# EAGLE design bbb_light_2021-04-30 (EAGLE 9.5.2)
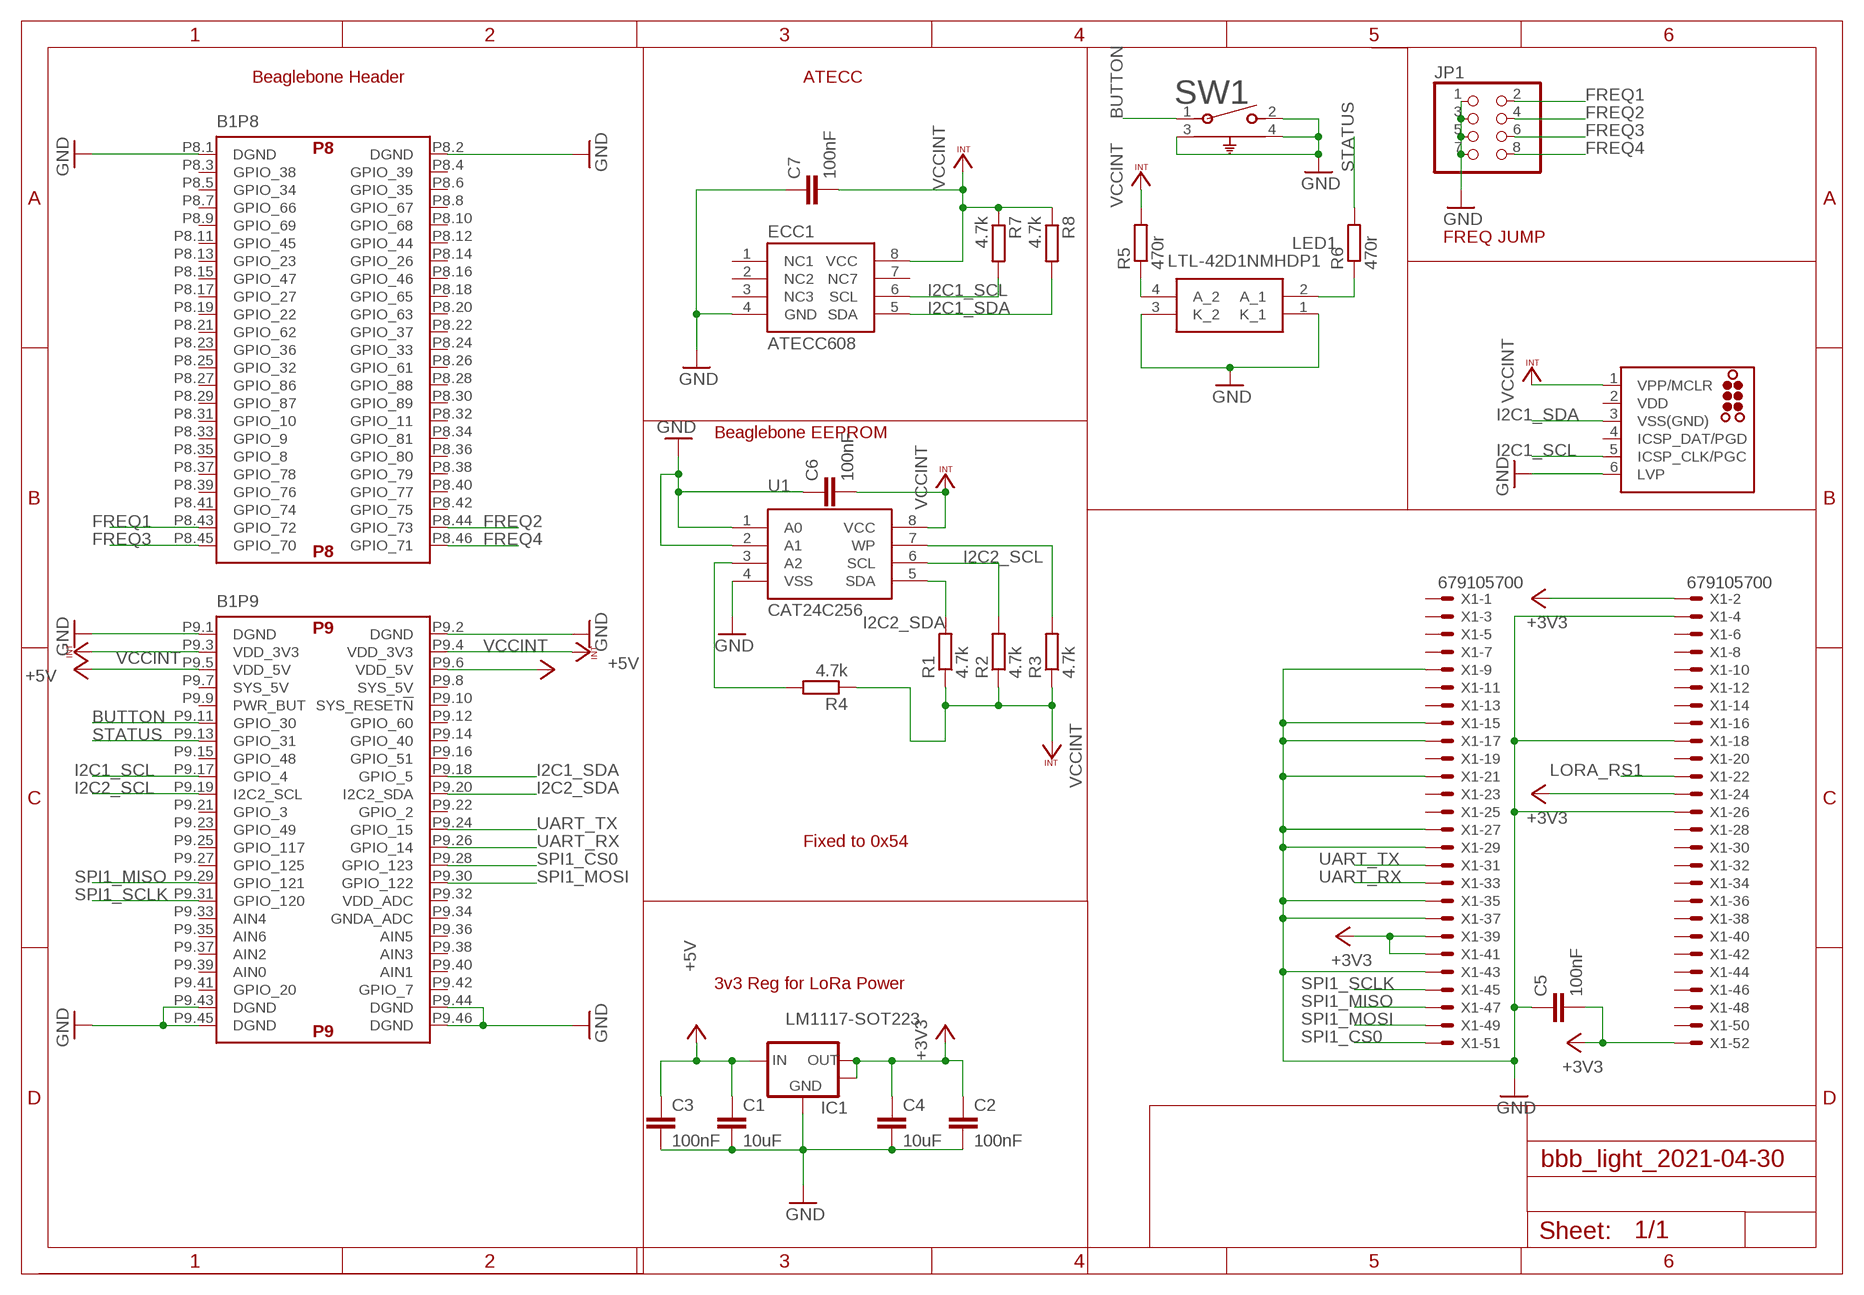
[diagram p0: schematic, sheet 1]

## Parts
B1  SPARKFUN_BEAGLE_BONE_BLACK_CAPE  [BEAGLE_BONE_BLACK_CAPE]
C1  10uF  C-EUC0603  [C0603]
C2  100nF  C-EUC0603  [C0603]
C3  100nF  C-EUC0603  [C0603]
C4  10uF  C-EUC0603  [C0603]
C5  100nF  C-EUC0603  [C0603]
C6  100nF  C-EUC0603  [C0603]
C7  100nF  C-EUC0603  [C0603]
ECC1  ATECC608  ATECC108  [SO08]
IC1  LM1117-SOT223  [SOT-223-3]
J1  TC2030-MCP-NL  [TC2030-MCP-NL]
JP1  PINHD-2X4  [2X04]
LED1  LTL-42D1NMHDP1  [LTL42D1NMHDP1]
R1  4.7k  R-EU_R0603  [R0603]
R2  4.7k  R-EU_R0603  [R0603]
R3  4.7k  R-EU_R0603  [R0603]
R4  4.7k  R-EU_R0603  [R0603]
R5  470r  R-EU_R0603  [R0603]
R6  470r  R-EU_R0603  [R0603]
R7  4.7k  R-EU_R0603  [R0603]
R8  4.7k  R-EU_R0603  [R0603]
SW1  1825027-8  [SW2_1825027-C_TEC]
U1  CAT24C256  CAT24C32WI-GT3  [SOIC8]
X1  679105700  [679105700]

## Nets
+3V3: C2.1 C4.1 C5.2 IC1.2(VOUT) IC1.4(HEATSINK) X1.2 X1.24 X1.39 X1.41 X1.52
+5V: B1.P9.5(P9:VDD_5V) B1.P9.6(P9:VDD_5V) C1.1 C3.1 IC1.3(VIN)
BUTTON: B1.P9.11(P9:GPIO_30) SW1.1
FREQ1: B1.P8.43(P8:GPIO_72) JP1.2
FREQ2: B1.P8.44(P8:GPIO_73) JP1.4
FREQ3: B1.P8.45(P8:GPIO_70) JP1.6
FREQ4: B1.P8.46(P8:GPIO_71) JP1.8
GND: B1.P8.1(P8:DGND) B1.P8.2(P8:DGND) B1.P9.1(P9:DGND) B1.P9.2(P9:DGND) B1.P9.43(P9:DGND) B1.P9.44(P9:DGND) B1.P9.45(P9:DGND) B1.P9.46(P9:DGND) C1.2 C2.2 C3.2 C4.2 C5.1 C6.1 C7.1 ECC1.4(GND) IC1.1(GND) J1.6(LVP) JP1.1 JP1.3 JP1.5 JP1.7 LED1.1(K_1) LED1.3(K_2) SW1.2 SW1.3 SW1.4 U1.1(A0) U1.2(A1) U1.4(VSS) X1.4 X1.9 X1.15 X1.17 X1.18 X1.21 X1.26 X1.27 X1.29 X1.35 X1.37 X1.43
I2C1_SCL: B1.P9.17(P9:GPIO_4) ECC1.6(SCL) J1.5(ICSP_CLK/PGC) R7.2
I2C1_SDA: B1.P9.18(P9:GPIO_5) ECC1.5(SDA) J1.3(VSS(GND)) R8.2
I2C2_SCL: B1.P9.19(P9:I2C2_SCL) R2.2 U1.6(SCL)
I2C2_SDA: B1.P9.20(P9:I2C2_SDA) R1.2 U1.5(SDA)
LORA_RS1: X1.22
N$3: R3.2 U1.7(WP)
N$4: R4.2 U1.3(A2)
N$5: LED1.4(A_2) R5.1
N$6: LED1.2(A_1) R6.1
SPI1_CS0: B1.P9.28(P9:GPIO_123) X1.51
SPI1_MISO: B1.P9.29(P9:GPIO_121) X1.47
SPI1_MOSI: B1.P9.30(P9:GPIO_122) X1.49
SPI1_SCLK: B1.P9.31(P9:GPIO_120) X1.45
STATUS: B1.P9.13(P9:GPIO_31) R6.2
UART_RX: B1.P9.26(P9:GPIO_14) X1.33
UART_TX: B1.P9.24(P9:GPIO_15) X1.31
VCCINT: B1.P9.3(P9:VDD_3V3) B1.P9.4(P9:VDD_3V3) C6.2 C7.2 ECC1.8(VCC) J1.1(VPP/MCLR) R1.1 R2.1 R3.1 R4.1 R5.2 R7.1 R8.1 U1.8(VCC)
Unconnected: B1.P8.3(P8:GPIO_38) B1.P8.4(P8:GPIO_39) B1.P8.5(P8:GPIO_34) B1.P8.6(P8:GPIO_35) B1.P8.7(P8:GPIO_66) B1.P8.8(P8:GPIO_67) B1.P8.9(P8:GPIO_69) B1.P8.10(P8:GPIO_68) B1.P8.11(P8:GPIO_45) B1.P8.12(P8:GPIO_44) B1.P8.13(P8:GPIO_23) B1.P8.14(P8:GPIO_26) B1.P8.15(P8:GPIO_47) B1.P8.16(P8:GPIO_46) B1.P8.17(P8:GPIO_27) B1.P8.18(P8:GPIO_65) B1.P8.19(P8:GPIO_22) B1.P8.20(P8:GPIO_63) B1.P8.21(P8:GPIO_62) B1.P8.22(P8:GPIO_37) B1.P8.23(P8:GPIO_36) B1.P8.24(P8:GPIO_33) B1.P8.25(P8:GPIO_32) B1.P8.26(P8:GPIO_61) B1.P8.27(P8:GPIO_86) B1.P8.28(P8:GPIO_88) B1.P8.29(P8:GPIO_87) B1.P8.30(P8:GPIO_89) B1.P8.31(P8:GPIO_10) B1.P8.32(P8:GPIO_11) B1.P8.33(P8:GPIO_9) B1.P8.34(P8:GPIO_81) B1.P8.35(P8:GPIO_8) B1.P8.36(P8:GPIO_80) B1.P8.37(P8:GPIO_78) B1.P8.38(P8:GPIO_79) B1.P8.39(P8:GPIO_76) B1.P8.40(P8:GPIO_77) B1.P8.41(P8:GPIO_74) B1.P8.42(P8:GPIO_75) B1.P9.7(P9:SYS_5V) B1.P9.8(P9:SYS_5V) B1.P9.9(P9:PWR_BUT) B1.P9.10(P9:SYS_RESET!N) B1.P9.12(P9:GPIO_60) B1.P9.14(P9:GPIO_40) B1.P9.15(P9:GPIO_48) B1.P9.16(P9:GPIO_51) B1.P9.21(P9:GPIO_3) B1.P9.22(P9:GPIO_2) B1.P9.23(P9:GPIO_49) B1.P9.25(P9:GPIO_117) B1.P9.27(P9:GPIO_125) B1.P9.32(P9:VDD_ADC) B1.P9.33(P9:AIN4) B1.P9.34(P9:GNDA_ADC) B1.P9.35(P9:AIN6) B1.P9.36(P9:AIN5) B1.P9.37(P9:AIN2) B1.P9.38(P9:AIN3) B1.P9.39(P9:AIN0) B1.P9.40(P9:AIN1) B1.P9.41(P9:GPIO_20) B1.P9.42(P9:GPIO_7) ECC1.1(NC1) ECC1.2(NC2) ECC1.3(NC3) ECC1.7(NC7) J1.4(ICSP_DAT/PGD) X1.1 X1.3 X1.5 X1.6 X1.7 X1.8 X1.10 X1.11 X1.12 X1.13 X1.14 X1.16 X1.19 X1.20 X1.23 X1.25 X1.28 X1.30 X1.32 X1.34 X1.36 X1.38 X1.40 X1.42 X1.44 X1.46 X1.48 X1.50

## Notes on the sheet
- Beaglebone Header | ATECC
- FREQ JUMP
- Beaglebone EEPROM
- Fixed to 0x54
- 3v3 Reg for LoRa Power

## Power pins joined to a net without a drawn wire
VDD: J1.2(VDD)

## Library data of the parts
B1 = SparkFun-Boards:SPARKFUN_BEAGLE_BONE_BLACK_CAPE: BeagleBone Black Rev C Cape Generic footprint for BeagleBone Black Rev C Capes. SparkFun Products: SparkFun BeagleBone Black Proto Cape <https://www.sparkfun.com/products/12774> SparkFun CryptoCape <https://www.sparkfun.com/products/12773>
C1-C7 = resistor:C-EU: CAPACITOR, European symbol
ECC1 = SparkFun-IC-Special-Function:ATECC108: ATECC108 ECDSA with NIST ATECC108: Provides ECDSA with NIST curves P256, B283, and K283. Also, a RNG, 8.5Kb EEPROM. 2.0V - 5.5V. Datasheet <https://cdn.sparkfun.com/datasheets/Dev/Beagle/Atmel-8873S-CryptoAuth-ATECC108-Datasheet-Summary.pdf> SparkFun Products CryptoCape <https://www.sparkfun.com/products/12773> (DEV-12773) SparkFun CryptoShield <https://www.sparkfun.com/products/13183> (DEV-13183); PROD_ID: IC-11982; VALUE: ATECC108
IC1 = bt_regulator:LM1117: LDO Voltage Regulator NCP1117 series are low dropout positive voltage regulators that are capable of providing an output current that is in excess of 1.0 A with a maximum dropout voltage of 1.2 V at 800 mA over temperature. This series contains nine fixed output voltages of 1.5 V, 1.8 V, 1.9 V, 2.0 V, 2.5 V, 2.85 V, 3.3 V, 5.0 V, and 12 V that have no minimum load requirement to maintain regulation. Also included is an adjustable output version that can be programmed from 1.25 V to 18.8 V with two external resistors. datasheet.pdf <http://www.onsemi.com/pub_link/Collateral/NCP1117-D.PDF> LM1117-N is a series of low dropout voltage regulators of 1.2V at 800mA of load current. It has the same pin-out as Texas Instruments' industry standard LM317. The LM1117-N is available in an adjustable version, available in five fixed voltages, 1.8V, 2.5V, 2.85V, 3.3V, and 5V. The LM1117-N offers current limiting and thermal shutdown. Its circuit includes a zener trimmed to within ±1%. datasheet.pdf <http://www.ti.com/lit/ds/symlink/lm1117-n.pdf>
J1 = One_Dimensional_Pong:TC2030: TAG-CONNECT ICSP Connector Manufacturer: Tag-Connect <http://www.tag-connect.com> Cable for easy In-Circuit Serial Programming. Designed for Microchip ICD2, suitable for many others. Two variants - one "with legs" (for hands-free fit on PCB) and another "without legs" for quick programming. PAD Description 1 MCLR/Vpp 2 Vdd 3 GND 4 PGD (ISPDAT) 5 PGC (ISPCLK) 6 nc (used for LVP) ©2009 ROFA.cz - modified and updated by Robert Darlington ‹rdarlington@gmail.com›
JP1 = pinhead:PINHD-2X4: PIN HEADER
LED1 = LTL-42D1NMHDP1:LTL-42D1NMHDP1: LED Circuit Board Indicators Housing LED ThruHole 3mm 2Lvl Grn/Yellow Source: Datasheet <https://datasheet.datasheetarchive.com/originals/distributors/Datasheets-305/79387.pdf>; ARROW_PART_NUMBER: LTL-42D1NMHDP1; ARROW_PRICE-STOCK: https://www.arrow.com/en/products/ltl-42d1nmhdp1/lite-on-technology; DESCRIPTION: LED Circuit Board Indicators Housing LED ThruHole 3mm 2Lvl Grn/Yellow; HEIGHT: 9.6mm; MANUFACTURER_NAME: Lite-On; MANUFACTURER_PART_NUMBER: LTL-42D1NMHDP1; MOUSER_PART_NUMBER: 859-LTL-42D1NMHDP1; MOUSER_PRICE-STOCK: https://www.mouser.co.uk/ProductDetail/Lite-On/LTL-42D1NMHDP1?qs=WxFF5lh7QM1L2xMrizlF%2FQ%3D%3D
R1-R8 = resistor:R-EU_: RESISTOR, European symbol
SW1 = ryanteck:1825027-8; BUILT_BY: EMA_UL_Team; CONFIGURATION__POLE-THROW_: Single Pole - Single Throw; COPYRIGHT: Copyright (C) 2016 Accelerated Designs. All rights reserved; DESCRIPTION: FSMRA3JH04=R/A,TACT PB SW,160G; MANUFACTURER_PART_NUMBER: 1825027-8; MAX_SWITCHING_CURRENT: -; MAX_SWITCHING_VOLTAGE_AC_: -; PRODUCT_TYPE: Switch; SOURCELIBRARY: TE_Connectivity-2018-03-16; SWITCH_TYPE: Tactile Switches; TE_PART_NUMBER: 1825027-8; VENDOR: TE Connectivity
U1 = Memory:CAT24C32WI-GT3: IC EEPROM 32K I2C 1MHZ 8SOIC Manufacturer's datasheet <https://www.onsemi.com/pub/Collateral/CAT24C32-D.PDF>; CREATED_BY: PCBLayout.com; DIGIKEY_PART_NUMBER: CAT24C32WI-GT3CT-ND; MANUFACTURER: ON Semiconductor; MPN: CAT24C32WI-GT3; PACKAGE: SOIC-8
X1 = con-molex-3:679105700: MINI PCI EXPRESS CONNECTOR 0.8MM PITCH, 52 CIRCUIT Source: http://www.molex.com/pdm_docs/sd/679105700_sd.pdf; MPN: 67910-5700; OC_FARNELL: unknown; OC_NEWARK: 93M2128

## Board
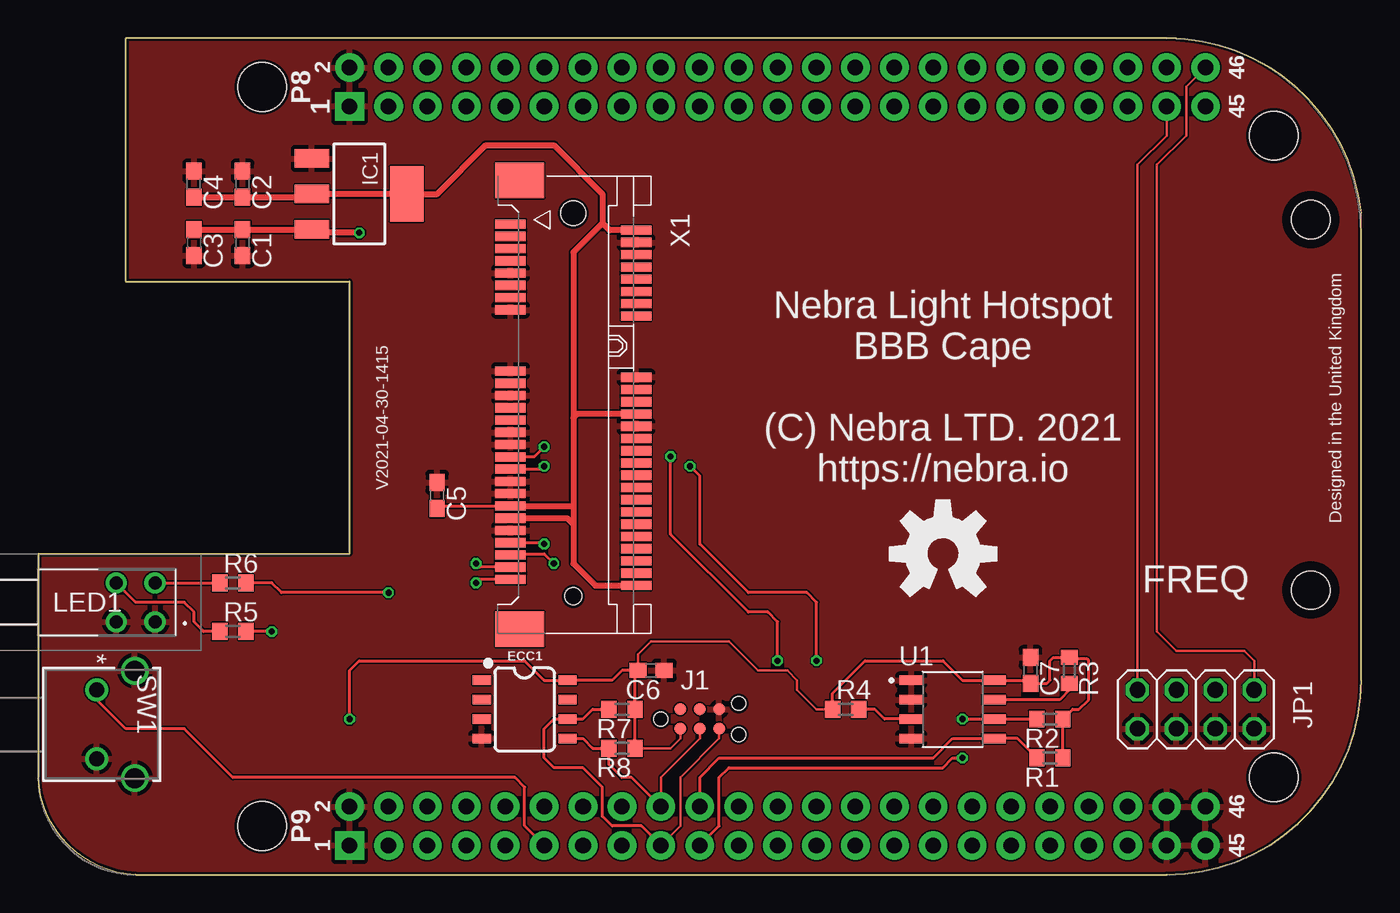
[diagram p1: board, top side]
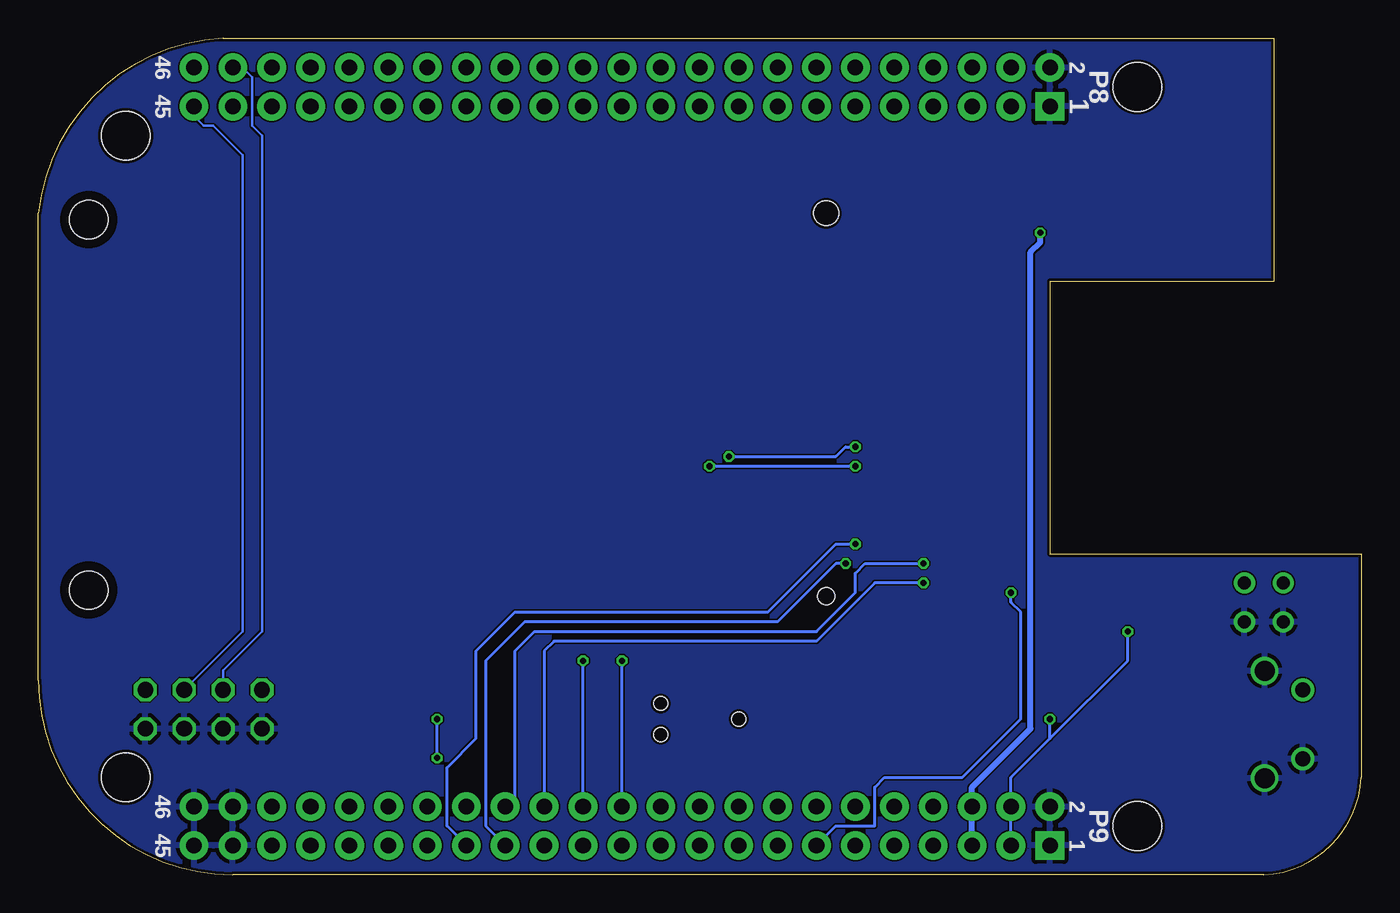
[diagram p2: board, bottom side, seen from below]

Size 86.36 x 54.61 mm. Coordinates in mm from the lower left corner, seen from the top.
Outline: 6.35,0 73.66,0 arc90 86.36,12.7 86.36,43.18 arc81 74.3,54.61 5.71,54.61 5.71,38.73 20.32,38.73 20.32,20.95 0,20.95 0,6.35 arc85 6.35,0
Copper layers (1*16): Top 0.035mm / dielectric 1.5mm / Bottom 0.035mm
Design rules "aisler_2_layer": minimum track width 0.1mm, minimum drill 0.2mm, track to track 0.1mm, track to pad 0.1mm, pad to pad 0.1mm, via to via 0.1mm, smd to smd 0.1mm, copper to edge 0.2mm, drill to drill 0.21mm, minimum pad ring 0.25mm, minimum via ring 0.15mm, stop-mask expansion 0mil, vias tented up to drill 0mil, thermal gap 10mil

### Footprints (pad centres in the part's own frame; a part is rotated, then mirrored left to right if it is on the bottom)
BEAGLE_BONE_BLACK_CAPE = drill 1.016 pad 1.88 square: P8.1 -24.13,20.955; P9.1 -24.13,-27.305 | drill 1.016 pad 1.88: P8.2 -24.13,23.495; P8.3 -21.59,20.955; P8.4 -21.59,23.495; P8.5 -19.05,20.955; P8.6 -19.05,23.495; P8.7 -16.51,20.955; P8.8 -16.51,23.495; P8.9 -13.97,20.955; P8.10 -13.97,23.495; P8.11 -11.43,20.955; P8.12 -11.43,23.495; P8.13 -8.89,20.955; P8.14 -8.89,23.495; P8.15 -6.35,20.955; P8.16 -6.35,23.495; P8.17 -3.81,20.955; P8.18 -3.81,23.495; P8.19 -1.27,20.955; P8.20 -1.27,23.495; P8.21 1.27,20.955; P8.22 1.27,23.495; P8.23 3.81,20.955; P8.24 3.81,23.495; P8.25 6.35,20.955; P8.26 6.35,23.495; P8.27 8.89,20.955; P8.28 8.89,23.495; P8.29 11.43,20.955; P8.30 11.43,23.495; P8.31 13.97,20.955; P8.32 13.97,23.495; P8.33 16.51,20.955; P8.34 16.51,23.495; P8.35 19.05,20.955; P8.36 19.05,23.495; P8.37 21.59,20.955; P8.38 21.59,23.495; P8.39 24.13,20.955; P8.40 24.13,23.495; P8.41 26.67,20.955; P8.42 26.67,23.495; P8.43 29.21,20.955; P8.44 29.21,23.495; P8.45 31.75,20.955; P8.46 31.75,23.495; P9.2 -24.13,-24.765; P9.3 -21.59,-27.305; P9.4 -21.59,-24.765; P9.5 -19.05,-27.305; P9.6 -19.05,-24.765; P9.7 -16.51,-27.305; P9.8 -16.51,-24.765; P9.9 -13.97,-27.305; P9.10 -13.97,-24.765; P9.11 -11.43,-27.305; P9.12 -11.43,-24.765; P9.13 -8.89,-27.305; P9.14 -8.89,-24.765; P9.15 -6.35,-27.305; P9.16 -6.35,-24.765; P9.17 -3.81,-27.305; P9.18 -3.81,-24.765; P9.19 -1.27,-27.305; P9.20 -1.27,-24.765; P9.21 1.27,-27.305; P9.22 1.27,-24.765; P9.23 3.81,-27.305; P9.24 3.81,-24.765; P9.25 6.35,-27.305; P9.26 6.35,-24.765; P9.27 8.89,-27.305; P9.28 8.89,-24.765; P9.29 11.43,-27.305; P9.30 11.43,-24.765; P9.31 13.97,-27.305; P9.32 13.97,-24.765; P9.33 16.51,-27.305; P9.34 16.51,-24.765; P9.35 19.05,-27.305; P9.36 19.05,-24.765; P9.37 21.59,-27.305; P9.38 21.59,-24.765; P9.39 24.13,-27.305; P9.40 24.13,-24.765; P9.41 26.67,-27.305; P9.42 26.67,-24.765; P9.43 29.21,-27.305; P9.44 29.21,-24.765; P9.45 31.75,-27.305; P9.46 31.75,-24.765 | hole 3.175: -29.845,-26.035; 36.195,-22.86; 36.195,19.05; -29.845,22.225
C0603 = smd 1.1 x 1: 1 -0.85,0; 2 0.85,0
SO08 = smd 0.6 x 1.2: 1 -1.905,-2.8; 2 -0.635,-2.8; 3 0.635,-2.8; 4 1.905,-2.8; 5 1.905,2.8; 6 0.635,2.8; 7 -0.635,2.8; 8 -1.905,2.8
SOT-223-3 = smd 1.219 x 2.235: 1 -2.311,-3.099; 2 0,-3.099; 3 2.311,-3.099 | smd 3.6 x 2.2: 4 0,3.099
TC2030-MCP-NL = smd 0.787 x 0.787: 1 1.27,-0.635; 2 1.27,0.635; 3 2.54,-0.635; 4 2.54,0.635; 5 3.81,-0.635; 6 3.81,0.635 | hole 0.889: 0,0; 5.08,-1.016; 5.08,1.016
2X04 = drill 1.016 octagon: 1 -3.81,-1.27; 2 -3.81,1.27; 3 -1.27,-1.27; 4 -1.27,1.27; 5 1.27,-1.27; 6 1.27,1.27; 7 3.81,-1.27; 8 3.81,1.27
LTL42D1NMHDP1 = drill 0.85 pad 1.381: 1 0,0; 2 0,2.54; 3 -2.54,0; 4 -2.54,2.54
R0603 = smd 1 x 1.1: 1 -0.85,0; 2 0.85,0
SW2_1825027-C_TEC = drill 0.991 pad 1.499: 1 0,0; 2 4.496,0 | drill 1.295 pad 1.803: 3 -1.245,2.489; 4 5.766,2.489
SOIC8 = smd 1.55 x 0.6: 1 -2.7,1.905; 2 -2.7,0.635; 3 -2.7,-0.635; 4 -2.7,-1.905; 5 2.7,-1.905; 6 2.7,-0.635; 7 2.7,0.635; 8 2.7,1.905
679105700 = smd 0.6 x 2: 1 0.7,-4.1; 2 1.1,4.1; 3 1.5,-4.1; 4 1.9,4.1; 5 2.3,-4.1; 6 2.7,4.1; 7 3.1,-4.1; 8 3.5,4.1; 9 3.9,-4.1; 10 4.3,4.1; 11 4.7,-4.1; 12 5.1,4.1; 13 5.5,-4.1; 14 5.9,4.1; 15 6.3,-4.1; 16 6.7,4.1; 17 10.3,-4.1; 18 10.7,4.1; 19 11.1,-4.1; 20 11.5,4.1; 21 11.9,-4.1; 22 12.3,4.1; 23 12.7,-4.1; 24 13.1,4.1; 25 13.5,-4.1; 26 13.9,4.1; 27 14.3,-4.1; 28 14.7,4.1; 29 15.1,-4.1; 30 15.5,4.1; 31 15.9,-4.1; 32 16.3,4.1; 33 16.7,-4.1; 34 17.1,4.1; 35 17.5,-4.1; 36 17.9,4.1; 37 18.3,-4.1; 38 18.7,4.1; 39 19.1,-4.1; 40 19.5,4.1; 41 19.9,-4.1; 42 20.3,4.1; 43 20.7,-4.1; 44 21.1,4.1; 45 21.5,-4.1; 46 21.9,4.1; 47 22.3,-4.1; 48 22.7,4.1; 49 23.1,-4.1; 50 23.5,4.1; 51 23.9,-4.1; 52 24.3,4.1 | smd 2.3 x 3.2: M1 27.15,-3.5; M2 -2.15,-3.5 | hole 1.6: 0,0 | hole 1.1: 25,0 | hole 2.5: 0.4,48.15; 24.6,48.15

### Placement (x,y rotation side)
B1  44.45,29.21 0 top
C1  13.34,41.27 270 top
C2  13.34,45.09 90 top
C3  10.16,41.27 270 top
C4  10.16,45.09 90 top
C5  26.04,24.77 270 top
C6  40.01,13.34 180 top
C7  64.77,13.34 270 top
ECC1  31.75,10.79 270 top
IC1  20.95,44.45 270 top
J1  40.64,10.16 0 top
JP1  75.56,10.79 0 top
LED1  7.62,16.51 0 top
R1  66.04,7.62 180 top
R2  66.04,10.16 180 top
R3  67.31,13.34 270 top
R4  52.7,10.79 0 top
R5  12.7,15.88 0 top
R6  12.7,19.05 0 top
R7  38.1,10.79 180 top
R8  38.1,8.26 180 top
SW1  3.81,12.06 270 top
U1  59.69,10.79 0 top
U$1  [OSHW-LOGO-L]  59.05,20.95 0 top
X1  34.92,43.18 270 top

### Tracks (layer width: path | path; a pad name or v marks a point on that pad's centre or on a via)
+3V3
  Top 0.203: C5.2 26.2,24.08 X1.39
  Top 0.406: C4.1 C2.1 17.64,44.23 IC1.2 IC1.4 26.04,44.45 29.21,47.62 33.66,47.62 36.83,44.45 36.83,42.55 | X1.52 36.37,18.88 34.92,20.32 34.92,22.86 | 36.83,42.55 34.92,40.64 34.92,29.84 | 34.92,29.84 34.92,24.13 | 34.92,24.13 34.92,22.86 | X1.24 35.16,30.08 34.92,29.84 | X1.2 37.3,42.08 36.83,42.55 | X1.41 34.51,23.28 34.92,22.86 | X1.39 34.88,24.08 34.92,24.13
+5V  (via drill 0.4)
  Top 0.406: v20.95,41.91 18.09,41.91 IC1.3 17.84,42.12 C1.1 C3.1
  Bottom 0.406: B1.P9.5 B1.P9.6 25.4,5.71 21.59,9.53 21.59,40.64 20.95,41.27 v20.95,41.91
BUTTON
  Top 0.203: B1.P9.11 31.75,3.17 31.75,5.71 31.11,6.35 12.7,6.35 9.53,9.53 5.71,9.53 3.81,11.43 SW1.1
FREQ1
  Top 0.152: JP1.2 71.75,46.35 73.66,48.26 B1.P8.43
FREQ2
  Bottom 0.152: JP1.4 74.3,13.34 71.75,15.88 71.75,48.26 72.39,48.9 72.39,52.07 73.03,52.7 B1.P8.44
FREQ3
  Bottom 0.152: JP1.6 73.03,15.88 73.03,46.99 74.93,48.9 75.56,48.9 76.2,49.53 B1.P8.45
FREQ4
  Top 0.152: JP1.8 79.38,13.97 78.74,14.61 74.3,14.61 73.03,15.88 73.03,46.35 74.93,48.26 74.93,51.44 B1.P8.46
GND
  pour Top: -3.17,-3.81 -3.17,56.52 -1.27,58.42 87,58.42 90.81,54.61 90.81,0.64 85.72,-4.45 -2.54,-4.45
  pour Bottom: -3.17,-3.17 -3.17,57.15 -1.27,59.05 87,59.05 90.81,55.24 90.81,1.27 85.72,-3.81 -2.54,-3.81
I2C1_SCL
  Top 0.152: B1.P9.17 41.91,3.17 41.91,6.35 44.45,8.89 J1.5
  Top 0.203: R7.2 36.2,10.79 35.56,10.16 ECC1.6 33.66,10.16 33.02,9.53 33.02,7.62 33.66,6.99 35.56,6.99 36.83,5.71 36.83,3.81 37.47,3.17 39.37,3.17 B1.P9.17
I2C1_SDA
  Top 0.152: B1.P9.18 40.64,6.35 43.18,8.89 J1.3
  Top 0.203: ECC1.5 35.56,8.89 36.2,8.26 R8.2 37.25,7.2 38.1,6.35 38.73,6.35 B1.P9.18
I2C2_SCL  (via drill 0.4)
  Top 0.203: R2.2 U1.6 v60.33,10.16 | v60.33,7.62 59.69,7.62 59.05,6.99 45.09,6.99 44.45,6.35 44.45,3.17 B1.P9.19
  Bottom 0.203: v60.33,7.62 v60.33,10.16
I2C2_SDA
  Top 0.203: R1.2 63.92,8.89 U1.5 59.69,8.89 58.42,7.62 44.45,7.62 43.18,6.35 B1.P9.20
N$3
  Top 0.203: R3.2 67.31,12.06 66.67,11.43 U1.7
N$4
  Top 0.203: U1.3 55.24,10.16 54.61,10.79 R4.2
N$5
  Top 0.203: LED1.4 6.35,17.78 9.53,17.78 10.16,17.14 10.16,16.51 10.79,15.88 R5.1
N$6
  Top 0.203: LED1.2 R6.1
SPI1_CS0  (via drill 0.4)
  Top 0.203: X1.51 28.8,19.28 v28.57,19.05
  Bottom 0.203: v28.57,19.05 31.75,19.05 35.56,15.24 52.7,15.24 53.34,14.61 B1.P9.28
SPI1_MISO  (via drill 0.4)
  Top 0.203: X1.47 30.9,20.95 33.02,20.95 v33.66,20.32
  Bottom 0.203: v33.66,20.32 34.29,20.32 38.1,16.51 54.61,16.51 57.15,13.97 57.15,3.17 B1.P9.29
SPI1_MOSI  (via drill 0.4)
  Top 0.203: X1.49 28.82,20.08 v28.57,20.32
  Bottom 0.203: B1.P9.30 55.24,5.08 55.24,14.61 53.98,15.88 35.56,15.88 33.02,18.41 33.02,19.68 32.38,20.32 v28.57,20.32
SPI1_SCLK  (via drill 0.4)
  Top 0.203: X1.45 32.93,21.68 v33.02,21.59
  Bottom 0.203: B1.P9.31 59.69,3.17 59.69,6.99 57.78,8.89 57.78,14.61 55.24,17.14 38.73,17.14 34.29,21.59 v33.02,21.59
STATUS  (via drill 0.4)
  Top 0.203: v22.86,18.41 15.88,18.41 15.24,19.05 R6.2
  Bottom 0.203: B1.P9.13 34.29,3.17 31.75,3.17 31.75,5.71 31.11,6.35 26.04,6.35 22.23,10.16 22.23,17.14 22.86,17.78 v22.86,18.41
UART_RX  (via drill 0.4)
  Top 0.203: v50.8,13.97 50.8,17.78 50.16,18.41 46.35,18.41 43.18,21.59 43.18,26.04 v42.55,26.67 | X1.33 32.83,26.48 v33.02,26.67
  Bottom 0.203: v42.55,26.67 v33.02,26.67 | B1.P9.26 v50.8,13.97
UART_TX  (via drill 0.4)
  Top 0.203: v48.26,13.97 48.26,16.51 47.62,17.14 46.35,17.14 41.27,22.23 v41.27,27.3 | X1.31 30.85,27.3 32.38,27.3 v33.02,27.94
  Bottom 0.203: v41.27,27.3 34.29,27.3 33.66,27.94 v33.02,27.94 | B1.P9.24 v48.26,13.97
VCCINT  (via drill 0.4)
  Top 0.152: R8.1 41.27,8.26 41.91,8.89 J1.1 | R4.1 50.8,10.79 49.53,12.06 49.53,12.7 48.9,13.34 46.99,13.34 45.09,15.24 40.01,15.24 39.16,14.39 C6.2
  Top 0.203: v15.24,15.88 R5.2 | v20.32,10.16 20.32,13.34 20.95,13.97 31.75,13.97 33.02,12.7 ECC1.8 37.47,12.7 38.1,13.34 C6.2 38.95,13.13 R7.1 R8.1 | R4.1 51.85,11.85 53.98,13.97 59.05,13.97 60.33,12.7 U1.8 64.56,12.7 C7.2 65.83,12.48 66.04,12.7 66.04,13.97 66.25,14.19 R3.1 67.42,14.08 68.47,14.08 68.58,13.97 68.58,11.43 67.94,10.79 67.53,10.79 R2.1 R1.1
  Bottom 0.203: B1.P9.3 B1.P9.4 22.86,6.35 20.32,8.89 | 20.32,8.89 15.24,13.97 v15.24,15.88 | 20.32,8.89 v20.32,10.16

### Text on the board
tNames: Nebra Light Hotspot / BBB Cape / / (C) Nebra LTD. 2021 / https://nebra.io | Designed in the United Kingdom | V2021-04-30-1415 | FREQ
tValues: 433 | 470 | 868 | 915